# Altium schematic sheet Main.SchDoc
size A4; SheetNumber: 2; SheetTotal: 2
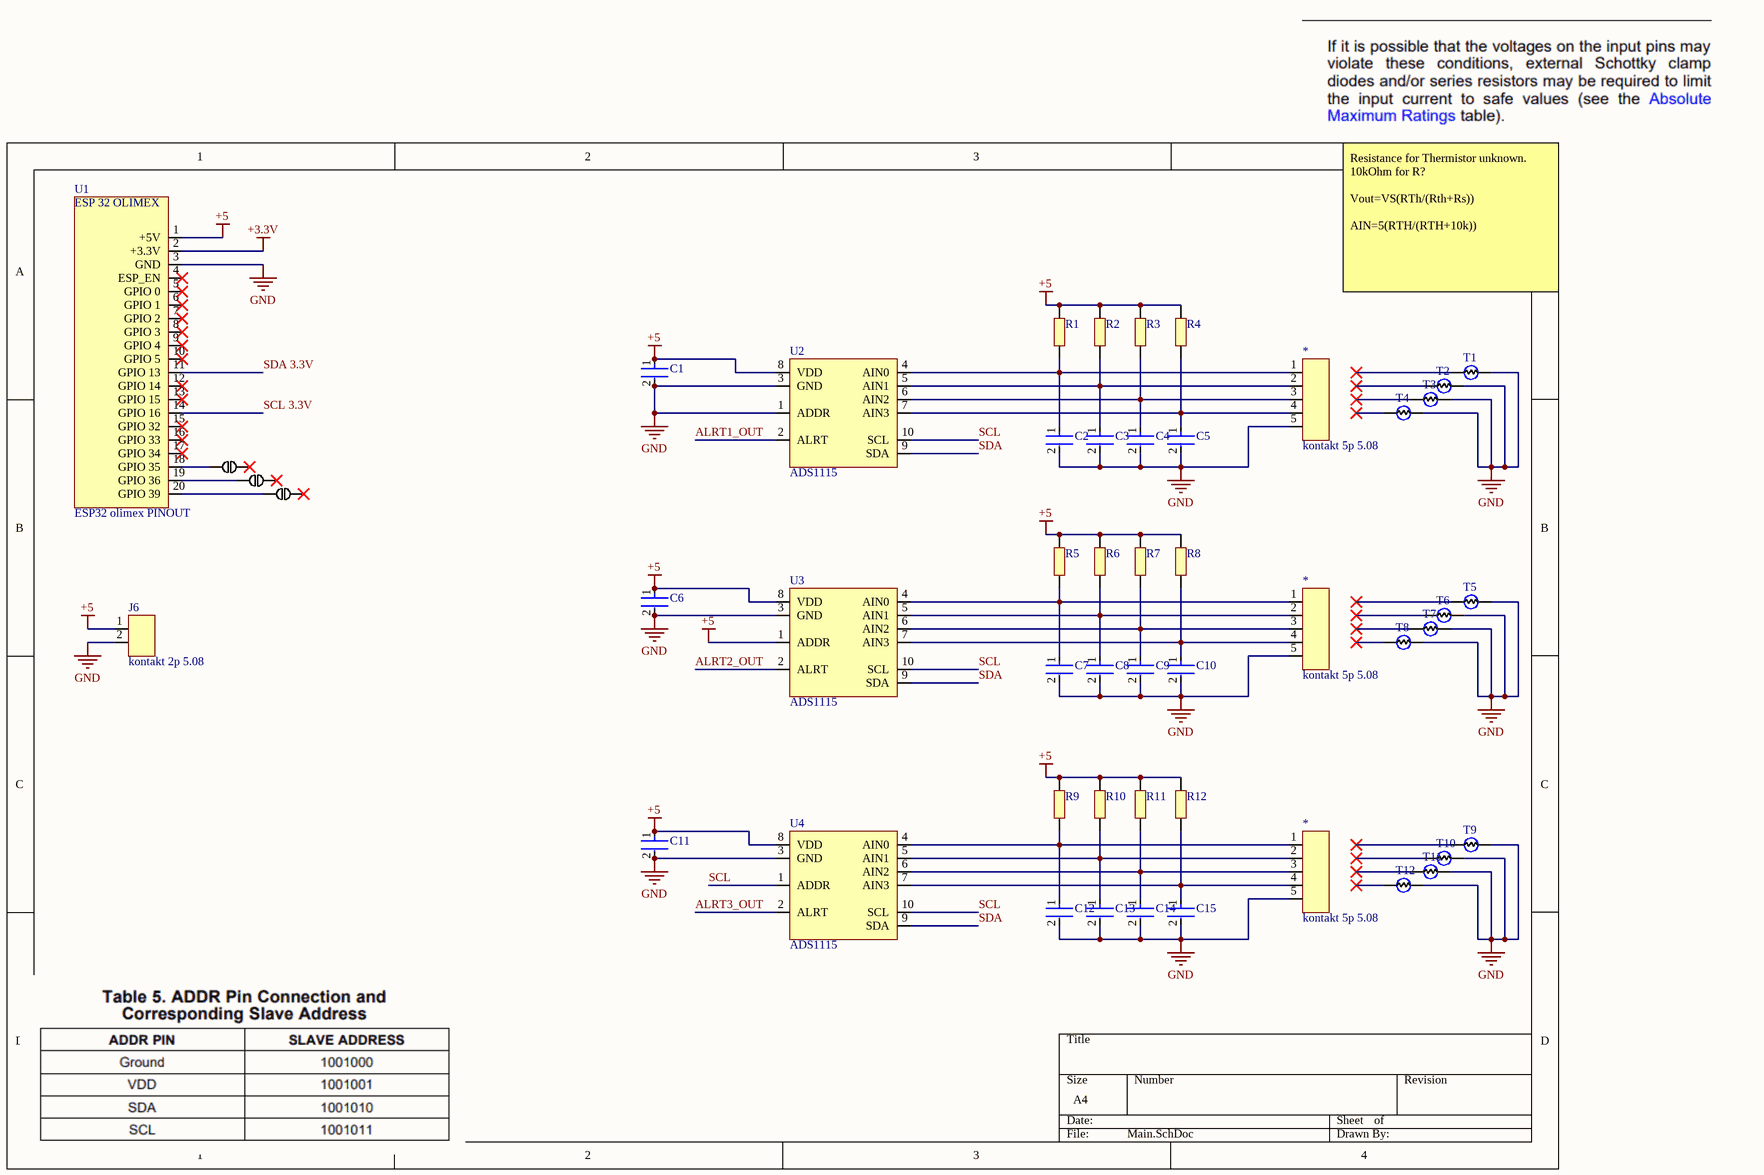
[diagram p0: Main.SchDoc]

## Parts
(Parts that share a designator on the sheet are numbered #1, #2 ... from top to bottom, then left to right.)
*#1  kontakt 5p 5.08  [Kontakt 5P 3.5]
*#2  kontakt 5p 5.08  [Kontakt 5P 3.5]
*#3  kontakt 5p 5.08  [Kontakt 5P 3.5]
C1  CC0603KRX7R9BB104  [FP-CC0603-DA-MFG]  (value not drawn)
C2  CL10A106MA8NRNC  [FP-CL10-IPC_C]  (value not drawn)
C3  CL10A106MA8NRNC  [FP-CL10-IPC_C]  (value not drawn)
C4  CL10A106MA8NRNC  [FP-CL10-IPC_C]  (value not drawn)
C5  CL10A106MA8NRNC  [FP-CL10-IPC_C]  (value not drawn)
C6  CC0603KRX7R9BB104  [FP-CC0603-DA-MFG]  (value not drawn)
C7  CL10A106MA8NRNC  [FP-CL10-IPC_C]  (value not drawn)
C8  CL10A106MA8NRNC  [FP-CL10-IPC_C]  (value not drawn)
C9  CL10A106MA8NRNC  [FP-CL10-IPC_C]  (value not drawn)
C10  CL10A106MA8NRNC  [FP-CL10-IPC_C]  (value not drawn)
C11  CC0603KRX7R9BB104  [FP-CC0603-DA-MFG]  (value not drawn)
C12  CL10A106MA8NRNC  [FP-CL10-IPC_C]  (value not drawn)
C13  CL10A106MA8NRNC  [FP-CL10-IPC_C]  (value not drawn)
C14  CL10A106MA8NRNC  [FP-CL10-IPC_C]  (value not drawn)
C15  CL10A106MA8NRNC  [FP-CL10-IPC_C]  (value not drawn)
J2  Solder jumper  (value not drawn)
J3  Solder jumper  (value not drawn)
J4  Solder jumper  (value not drawn)
J6  kontakt 2p 5.08  [Kontakt 2P 5.08]
R1  R0603  (value not drawn)
R2  R0603  (value not drawn)
R3  R0603  (value not drawn)
R4  R0603  (value not drawn)
R5  R0603  (value not drawn)
R6  R0603  (value not drawn)
R7  R0603  (value not drawn)
R8  R0603  (value not drawn)
R9  R0603  (value not drawn)
R10  R0603  (value not drawn)
R11  R0603  (value not drawn)
R12  R0603  (value not drawn)
T1  thermistor  (value not drawn)
T2  thermistor  (value not drawn)
T3  thermistor  (value not drawn)
T4  thermistor  (value not drawn)
T5  thermistor  (value not drawn)
T6  thermistor  (value not drawn)
T7  thermistor  (value not drawn)
T8  thermistor  (value not drawn)
T9  thermistor  (value not drawn)
T10  thermistor  (value not drawn)
T11  thermistor  (value not drawn)
T12  thermistor  (value not drawn)
U1  ESP32 olimex PINOUT  [ESP32 OLIMEX POE]
U2  ADS1115  [TSSOP50P490X110-10N ADS1115]
U3  ADS1115  [TSSOP50P490X110-10N ADS1115]
U4  ADS1115  [TSSOP50P490X110-10N ADS1115]

## Nets
+3.3V: U1.2(+3.3V)
+5: C1.1 C6.1 C11.1 J6.1 R1.2 R2.2 R3.2 R4.2 R5.2 R6.2 R7.2 R8.2 R9.2 R10.2 R11.2 R12.2 U1.1(+5V) U2.8(VDD) U3.1(ADDR) U3.8(VDD) U4.8(VDD)
GND: *#1.5 *#2.5 *#3.5 C1.2 C2.2 C3.2 C4.2 C5.2 C6.2 C7.2 C8.2 C9.2 C10.2 C11.2 C12.2 C13.2 C14.2 C15.2 J6.2 T1.2 T2.2 T3.2 T4.2 T5.2 T6.2 T7.2 T8.2 T9.2 T10.2 T11.2 T12.2 U1.3(GND) U2.1(ADDR) U2.3(GND) U3.3(GND) U4.3(GND)
ALRT1_OUT: U2.2(ALRT)
ALRT2_OUT: U3.2(ALRT)
ALRT3_OUT: U4.2(ALRT)
SCL: U2.10(SCL) U3.10(SCL) U4.1(ADDR) U4.10(SCL)
SCL 3.3V: U1.14(GPIO_16)
SDA: U2.9(SDA) U3.9(SDA) U4.9(SDA)
SDA 3.3V: U1.11(GPIO_13)
Net*#1_1: *#1.1 C2.1 R1.1 U2.4(AIN0)
Net*#1_2: *#1.2 C3.1 R2.1 U2.5(AIN1)
Net*#1_3: *#1.3 C4.1 R3.1 U2.6(AIN2)
Net*#1_4: *#1.4 C5.1 R4.1 U2.7(AIN3)
Net*#2_1: *#2.1 C7.1 R5.1 U3.4(AIN0)
Net*#2_2: *#2.2 C8.1 R6.1 U3.5(AIN1)
Net*#2_3: *#2.3 C9.1 R7.1 U3.6(AIN2)
Net*#2_4: *#2.4 C10.1 R8.1 U3.7(AIN3)
Net*#3_1: *#3.1 C12.1 R9.1 U4.4(AIN0)
Net*#3_2: *#3.2 C13.1 R10.1 U4.5(AIN1)
Net*#3_3: *#3.3 C14.1 R11.1 U4.6(AIN2)
Net*#3_4: *#3.4 C15.1 R12.1 U4.7(AIN3)
NetJ2_23: J2.23 U1.18(GPIO_35)
NetJ3_23: J3.23 U1.19(GPIO_36)
NetJ4_23: J4.23 U1.20(GPIO_39)

Not connected (* = marked no-connect by the designer): J2 24*; J3 24*; J4 24*; T1 1*; T2 1*; T3 1*; T4 1*; T5 1*; T6 1*; T7 1*; T8 1*; T9 1*; T10 1*; T11 1*; T12 1*; U1 4(ESP_EN)* 5(GPIO_0)* 6(GPIO_1)* 7(GPIO_2)* 8(GPIO_3)* 9(GPIO_4)* 10(GPIO_5)* 12(GPIO_14)* 13(GPIO_15)* 15(GPIO_32)* 16(GPIO_33)* 17(GPIO_34)*

## Notes on the sheet
- Resistance for Thermistor unknown.
  10kOhm for R?
  Vout=VS(RTh/(Rth+Rs))
  AIN=5(RTH/(RTH+10k))
- (in symbol ESP32 olimex PINOUT) ESP 32 OLIMEX

## Library data of the parts
C1 C6 C11 = CMP-2100-03601-2: CAP CER 0.1UF 50V X7R 0603; Manufacturer: YAGEO; Material: Ceramic; Capacitance: 100 nF; Temperature Coefficient: 15%; Tolerance: 0.1; Value: 100 nF; Height: 0.9mm; Voltage: 50 V; ComponentLink2Description: Datasheet; Device Class L2: Capacitors; Temperature Range High: +125°C; Category: Cap; Footprint Url: http://www.yageo.com/exep/pages/download/literatures/UPY-C_GEN_24.pdf; ComponentLink2URL: http://www.yageo.com/documents/recent/UPY-GPHC_X7R_6.3V-to-50V_18.pdf; Package: CC0603-DA; Temperature: -55°C to +125°C; Voltage Rating: 50 V; Temperature Characteristic: X7R; Device Class L1: Passive Components; Temperature Range Low: -55°C; Manufacturer Part Number: CC0603KRX7R9BB104; RoHS: TRUE; Automotive: No; Device Class L3: Ceramic Capacitors; Octopart: https://octopart.com/cc0603krx7r9bb104-yageo-42244635; Mouser Description: Multilayer Ceramic Capacitor, CC Series, 0.1 - F, - 10%, X7R, 50 V, 0603 [1608 Metric]; Lead Free: Yes; Digikey Description: CAP CER 0.1UF 50V X7R 0603
C2-C5 C7-C10 C12-C15 = CMP-13271-004224-1: Cap Ceramic 10uF 25V X5R ±20% Pad SMD 0603 +85°C T/R; Width: 0.031inch; Voltage Rating: 25V; Length: 0.063inch; Case Code (Metric): 1608; Dielectric: X5R; Termination: Wraparound; Capacitance: 10uF; Lead Free: Lead Free; Mount: Surface Mount; Package Quantity: 1; Case Code (Imperial): 0603; Thickness: 0.035inch; Packaging: Tape and Reel; Contact Plating: Tin; Min Operating Temperature: -55°C; Tolerance: 20%; Max Operating Temperature: 85°C; Case/Package: 0603
R1-R12 = R0603: 贴片电阻 10KΩ ± 1.00% 0.1W ± 100ppm/℃ 0603; Manufacturer: Royal Electronic Factory; Manufacturer Part Number: 0603WAF1002T5E; Value: 10kR; Supplier: Mouser; Supplier Part Number: 303-0603WAF1002T5E; RoHS: No; Category: LDO; Stock: 320000; Pricing: 10000=0,001 (USD)
T1-T12 = thermistor: 2.8kOhm
U2-U4 = ADS1113: 4-Channel Single ADC Delta-Sigma 860sps 16-bit Serial 10-Pin VSSOP T/R; Manufacturer: Texas Instruments; Manufacturer Part Number: ADS1115IDGSR; Interface: I2C; Number of Bits: 16; Sampling Rate: 860S/s; Number of A/D Converters: 1; Resolution: 16b; Polarity: Bipolar; Min Supply Voltage: 2V; Max Supply Voltage: 5.5V; Conversion Rate: 0.86KS/s; Number of Inputs: 4; Integral Nonlinearity (INL): 1LSB; Power Dissipation: 900uW; Nominal Supply Current: 150uA; Number of Channels: 2; Supplier: Mouser; Supplier Part Number: 595-ADS1115IDGSR; RoHS: Yes; Category: Analog to Digital Converters (ADCs); Stock: 9640; Pricing: 1=5,34, 10=3,91, 50=3,91, 100=3,3, 1000=2,64, 10000=2,49 (USD); Case/Package: VSSOP; Pins: 10; Contact Plating: Gold; Min Operating Temperature: -40°C; Max Operating Temperature: 125°C; Package Quantity: 2500; Packaging: Tape and Reel; Number of Converters: 1; Supply Type: Single; Max Supply Voltage (DC): 5.5V; Min Supply Voltage (DC): 2V; Series: -; Length: 3mm; Width: 3mm; Height: 1.07mm; Thickness: 1.02mm; Lead Free: Lead Free; Reach SVHC Compliant: No; RoHS Compliant: Yes; ComponentLink1URL: https://datasheet.ciiva.com/4031/47725463s8438921n7713-4031028.pdf?src-supplier=Arrow+Electronics; ComponentLink1Description: https://datasheet.ciiva.com/4031/47725463s8438921n7713-4031028.pdf?src-supplier=Arrow+Electronics